# EAGLE schematic USB_Board (EAGLE 6.5.0)
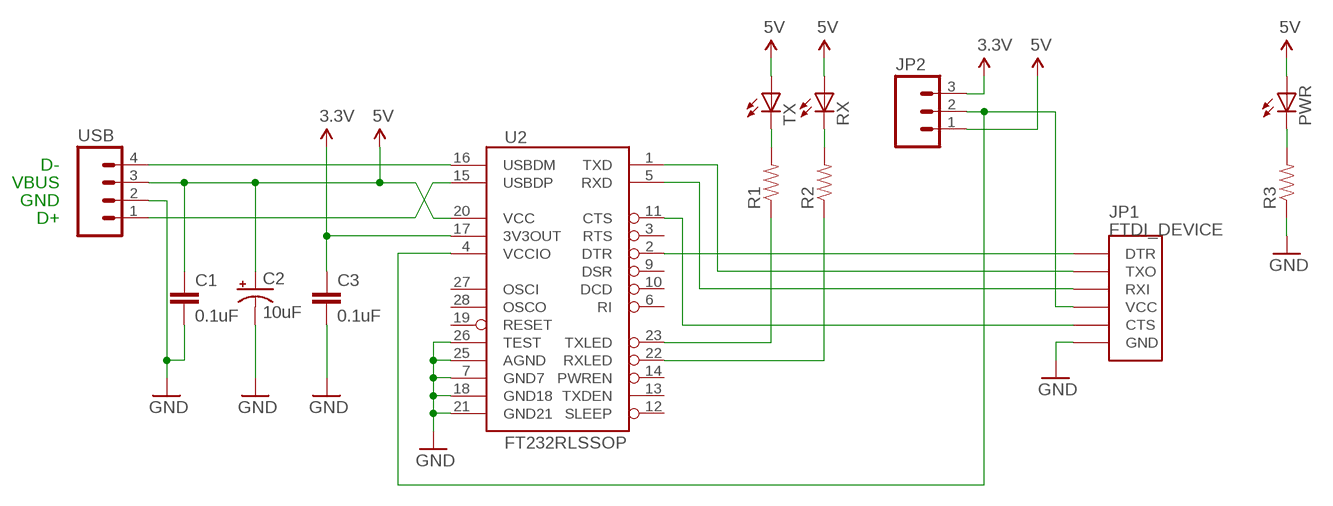
[diagram p0: schematic, sheet 1]

## Parts
C1  0.1uF  CAPEZ  [CAP-PTH-SMALLEZ]
C2  10uF  CAP_POLPTH2  [CPOL-RADIAL-10UF-25V]
C3  0.1uF  CAPEZ  [CAP-PTH-SMALLEZ]
JP1  FTDI_DEVICE  [FTDI_DEVICE_SIDE]
JP2  M03LOCK  [1X03_LOCK]
PWR  LED5MM  [LED5MM]
R1  10KOHM1/6W5%(PTH)KIT  [AXIAL-0.3-KIT]
R2  10KOHM1/6W5%(PTH)KIT  [AXIAL-0.3-KIT]
R3  10KOHM1/6W5%(PTH)KIT  [AXIAL-0.3-KIT]
RX  LED5MM  [LED5MM]
TX  LED5MM  [LED5MM]
U2  FT232RLSSOP  [SSOP28DB]
USB  M04LOCK  [1X04_LOCK]

## Nets
3.3V: C3.1 JP2.3 U2.17(3V3OUT)
5V: C1.1 C2.1(+) JP2.1 PWR.A RX.A TX.A U2.20(VCC) USB.3
GND: C1.2 C2.2(-) C3.2 JP1.P$6(GND) R3.P$1 U2.7(GND7) U2.18(GND18) U2.21(GND21) U2.25(AGND) U2.26(TEST) USB.2
N$2: U2.16(USBDM) USB.4
N$3: U2.15(USBDP) USB.1
N$7: JP1.P$2(TXO) U2.1(TXD)
N$8: JP1.P$3(RXI) U2.5(RXD)
N$9: JP1.P$5(CTS) U2.11(CTS)
N$10: JP1.P$1(DTR) U2.2(DTR)
N$11: JP1.P$4(VCC) JP2.2 U2.4(VCCIO)
N$13: R1.P$1 U2.23(TXLED)
N$14: R2.P$1 U2.22(RXLED)
N$15: R1.P$2 TX.K(C)
N$16: R2.P$2 RX.K(C)
N$17: PWR.K(C) R3.P$2
Unconnected: U2.3(RTS) U2.6(RI) U2.9(DSR) U2.10(DCD) U2.12(SLEEP) U2.13(TXDEN) U2.14(PWREN) U2.19(RESET) U2.27(OSCI) U2.28(OSCO)

## Notes on the sheet
- D-
- VBUS
- GND
- D+

## Library data of the parts
C1 C3 = SparkFun-Capacitors:CAP: Capacitor Standard 0603 ceramic capacitor, and 0.1" leaded capacitor.
C2 = SparkFun-Capacitors:CAP_POL: Capacitor Polarized These are standard SMD and PTH capacitors. Normally 10uF, 47uF, and 100uF in electrolytic and tantalum varieties. Always verify the external diameter of the through hole cap, it varies with capacity, voltage, and manufacturer. The EIA devices should be standard.
JP1 = SparkFun-Connectors:FTDI_DEVICE: Connector which mates to FTDI basic or FTDI cable.
JP2 = SparkFun-Connectors:M03: Header 3 Standard 3-pin 0.1" header. Use with straight break away headers (SKU : PRT-00116), right angle break away headers (PRT-00553), swiss pins (PRT-00743), machine pins (PRT-00117), and female headers (PRT-00115). Molex polarized connector foot print use with SKU : PRT-08232 with associated crimp pins and housings.
PWR RX TX = SparkFun-LED:LED: LEDs Standard schematic elements and footprints for 5mm, 3mm, 1206, and 0603 sized LEDs. 5mm - Spark Fun Electronics SKU : COM-00529 (and others)
R1-R3 = SparkFun-Resistors:10KOHM1/6W5%(PTH): RES-08375; PROD_ID: RES-08375
U2 = SparkFun-DigitalIC:FT232RL: USB UART FT232RL 4th Generation USB UART (USB <-> Serial) Controller. Spark Fun Electronics SKU : COM-00650 Production SKU IC-00870; PROD_ID: IC-00870
USB = SparkFun-Connectors:M04: Header 4 Standard 4-pin 0.1" header. Use with straight break away headers (SKU : PRT-00116), right angle break away headers (PRT-00553), swiss pins (PRT-00743), machine pins (PRT-00117), and female headers (PRT-00115). Molex polarized connector foot print use with SKU : PRT-08231 with associated crimp pins and housings. 1MM SMD Version SKU: PRT-10208